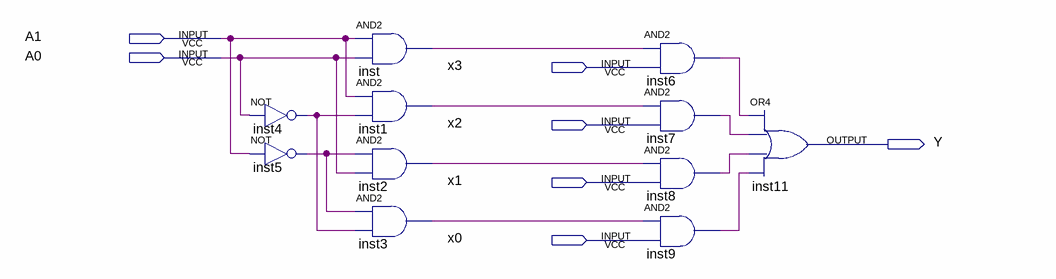
[diagram p0: schematic sheet]
// Quartus schematic MUX4-1.bdf as structural Verilog: 11 symbols, 7 pins
module \MUX4-1  (
  input  A1,
  input  A0,
  input  x3,
  input  x2,
  input  x1,
  input  x0,
  output Y
);

  wire inst1_out, inst2_out, inst3_out, inst4_out, inst5_out, inst6_out, inst7_out, inst8_out, inst9_out,
       inst_out;

  not inst4 (inst4_out, A0);
  not inst5 (inst5_out, A1);
  and inst (inst_out, A1, A0);
  and inst1 (inst1_out, A1, inst4_out);
  and inst2 (inst2_out, inst5_out, A0);
  and inst3 (inst3_out, inst5_out, inst4_out);
  and inst6 (inst6_out, inst_out, x3);
  and inst7 (inst7_out, inst1_out, x2);
  and inst8 (inst8_out, inst2_out, x1);
  and inst9 (inst9_out, inst3_out, x0);
  or inst11 (Y, inst6_out, inst7_out, inst8_out, inst9_out);
endmodule
